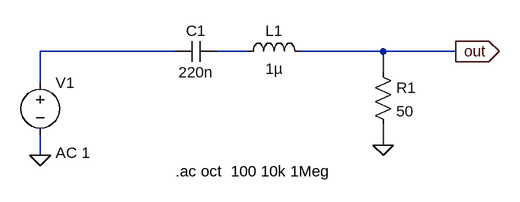
[diagram p0: schematic AC_interface_looking_to_line.asc]
AC_interface_looking_to_line.asc, the LTspice schematic file:
Version 4
SHEET 1 880 680
WIRE -64 112 -272 112
WIRE 48 112 0 112
WIRE 256 112 128 112
WIRE 368 112 256 112
WIRE 256 144 256 112
WIRE -272 160 -272 112
WIRE 256 256 256 224
WIRE -272 272 -272 240
FLAG 256 256 0
FLAG -272 272 0
FLAG 368 112 out
IOPIN 368 112 Out
SYMBOL cap 0 96 R90
WINDOW 0 0 32 VBottom 2
WINDOW 3 32 32 VTop 2
SYMATTR InstName C1
SYMATTR Value 220n
SYMBOL ind 32 128 R270
WINDOW 0 32 56 VTop 2
WINDOW 3 5 56 VBottom 2
SYMATTR InstName L1
SYMATTR Value 1µ
SYMBOL voltage -272 144 R0
WINDOW 3 24 152 Left 2
WINDOW 123 24 124 Left 2
WINDOW 39 0 0 Left 2
SYMATTR Value ""
SYMATTR Value2 AC 1
SYMATTR InstName V1
SYMBOL res 240 128 R0
SYMATTR InstName R1
SYMATTR Value 50
TEXT -64 296 Left 2 !.ac oct  100 10k 1Meg

The netlist it stands for:
* AC_interface_looking_to_line.asc
C1 N002 N001 220n
L1 N002 out 1µ
V1 N001 0 AC 1
R1 out 0 50
.ac oct  100 10k 1Meg
.backanno
.end